# Altium schematic sheet Channel.SchDoc
size A; SheetNumber: 2; SheetTotal: 3
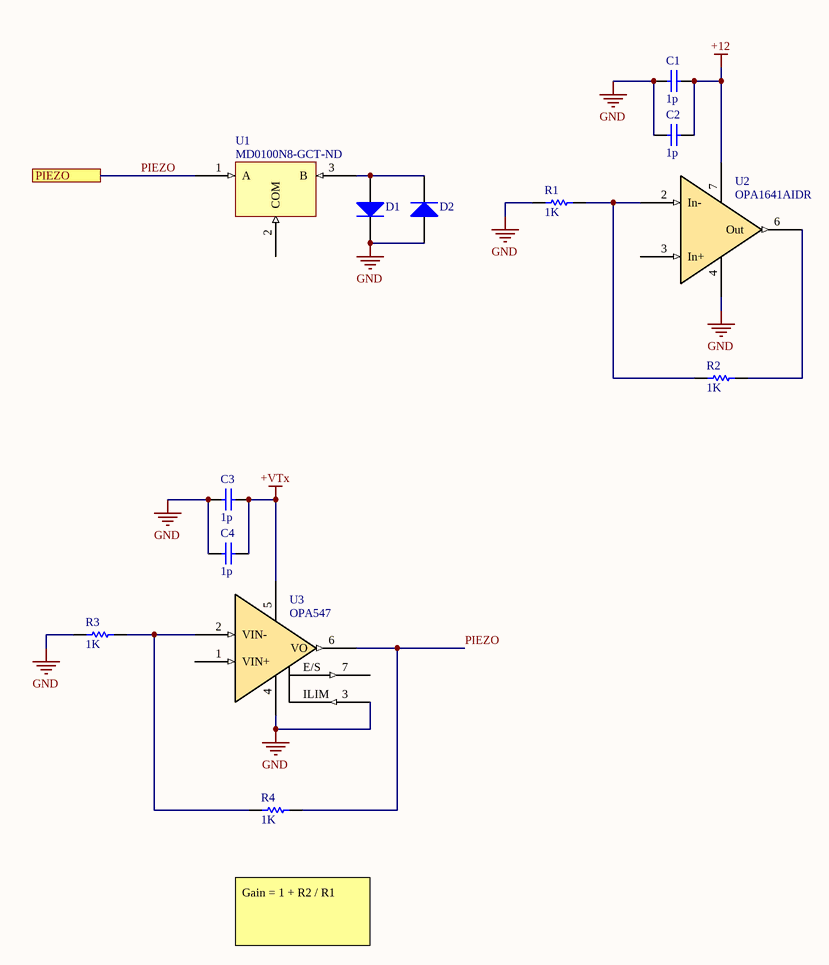
[diagram p0: Channel.SchDoc]

## Parts
C1  value 1p  (hidden comment: Capacitor)
C2  value 1p  (hidden comment: Capacitor)
C3  value 1p  (hidden comment: Capacitor)
C4  value 1p  (hidden comment: Capacitor)
D1  Diode  (value not drawn)
D2  Diode  (value not drawn)
R1  value 1K  (hidden comment: Resistor)
R2  value 1K  (hidden comment: Resistor)
R3  value 1K  (hidden comment: Resistor)
R4  value 1K  (hidden comment: Resistor)
U1  MD0100N8-GCT-ND
U2  OPA1641AIDR
U3  OPA547

## Ports
PIEZO

## Nets
+12: C1.2 C2.2 U2.7(V+)
+VTx: C3.2 C4.2 U3.5(V+)
GND: C1.1 C2.1 C3.1 C4.1 D1.2(K) D2.1(A) R1.2 R3.2 U2.4(V-) U3.3(ILIM) U3.4(V-)
PIEZO: R4.2 U1.1(A) U3.6(VO) ; port PIEZO
NetD1_1: D1.1(A) D2.2(K) U1.3(B)
NetR1_1: R1.1 R2.2 U2.2(In-)
NetR2_1: R2.1 U2.6(Out)
NetR3_1: R3.1 R4.1 U3.2(VIN-)

Not connected (* = marked no-connect by the designer): U1 2(COM); U2 3(In+); U3 1(VIN+) 7(E/S)

## Notes on the sheet
- Gain = 1 + R2 / R1

## Library data of the parts
C1-C4 = Capacitor: SimulationGenericComponent: True
D1 D2 = Diode: AF: 1; BV: 0; BV_MAX: 1e99; EG: 1.11; FC: 0.5; IBV: 0.001; ISR: 1e-14; MJSW: 0.33; NTUN: 30; TNOM: 27; XTI: 3; SimulationGenericComponent: True; CJO: 0; CJP: 0; CTA: 0; CTP: 0; FCS: 0.5; FV_MAX: 1e99; IKF: 0; IKR: 0; JSW: 0; JTUN: 0; JTUNSW: 0; KEG: 1; KF: 0; LEVEL: 1; N: 1; NBV: 1; NR: 1; NS: 1; PHP: 1; RS: 0; TCV: 0; TLEV: 0; TLEVC: 0; TM1: 0; TM2: 0; TPB: 0; TPHP: 0; TRS: 0; TRS2: 0; TT: 0; TTT1: 0; TTT2: 0; VJ: 1; XTITUN: 3; IS: 1e-14
R1-R4 = Resistor: TC1: 0; SimulationGenericComponent: True; TC2: 0
U1 = MD0100N8-GCT-ND: T/R Switch
U2 = OPA1641AIDR: JFET-input audio op-amp, 1 channel
U3 = OPA547: High-voltage, high-current op-amp